# EAGLE schematic Easy Digi (EAGLE 6.5.0)
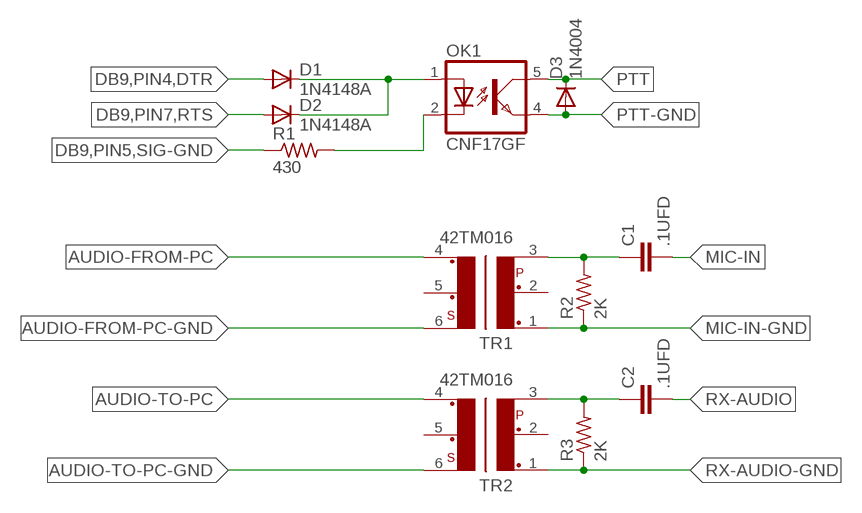
[diagram p0: schematic, sheet 1]

## Parts
C1  .1UFD  C5/3.5  [C5B3.5]
C2  .1UFD  C5/3.5  [C5B3.5]
D1  1N4148A  1N4148DO35-10  [DO35-10]
D2  1N4148A  1N4148DO35-10  [DO35-10]
D3  1N4004  [DO41-10]
OK1  CNF17GF  [DIL06B]
R1  430  R-US_0204/7  [0204/7]
R2  2K  R-US_0204/7  [0204/7]
R3  2K  R-US_0204/7  [0204/7]
TR1  42TM016  [42TM]
TR2  42TM016  [42TM]

## Nets
AUDIO-FROM-PC: TR1.4
AUDIO-FROM-PC-GND: TR1.6
AUDIO-TO-PC: TR2.4
AUDIO-TO-PC-GND: TR2.6
DB9,PIN4,DTR: D1.A
DB9,PIN5,SIG-GND: R1.1
DB9,PIN7,RTS: D2.A
MIC-IN: C1.2
MIC-IN-GND: R2.1 TR1.1
N$1: D1.C D2.C OK1.1(A)
N$2: OK1.2(C) R1.2
N$5: C1.1 R2.2 TR1.3
N$7: C2.1 R3.2 TR2.3
PTT: D3.C OK1.5(COL)
PTT-GND: D3.A OK1.4(EMIT)
RX-AUDIO: C2.2
RX-AUDIO-GND: R3.1 TR2.1
Unconnected: TR1.2 TR1.5 TR2.2 TR2.5

## Library data of the parts
C1 C2 = capacitor-wima:C: CAPACITOR naming: grid - package width
D1 D2 = diode:1N4148: DIODE high speed (Philips)
D3 = diode:1N4004: DIODE general purpose rectifier, 1 A
OK1 = optocoupler:CNF17GF: HEWLETT PACKARD OPTO COUPLER; OC_FARNELL: unknown; OC_NEWARK: unknown
R1-R3 = resistor:R-US_: RESISTOR, American symbol
TR1 TR2 = trafo-xicon:42T?*: Xicon Micro-Mini EI-12 Audio Transformers 42TL/42TC/42TM Series Source: http://www.mouser.com//catalog/specsheets/164201.pdf http://www.mouser.com/catalog/specsheets/114225.pdf http://www.mouser.com/catalog/specsheets/164267.pdf; OC_FARNELL: unknown; OC_NEWARK: unknown